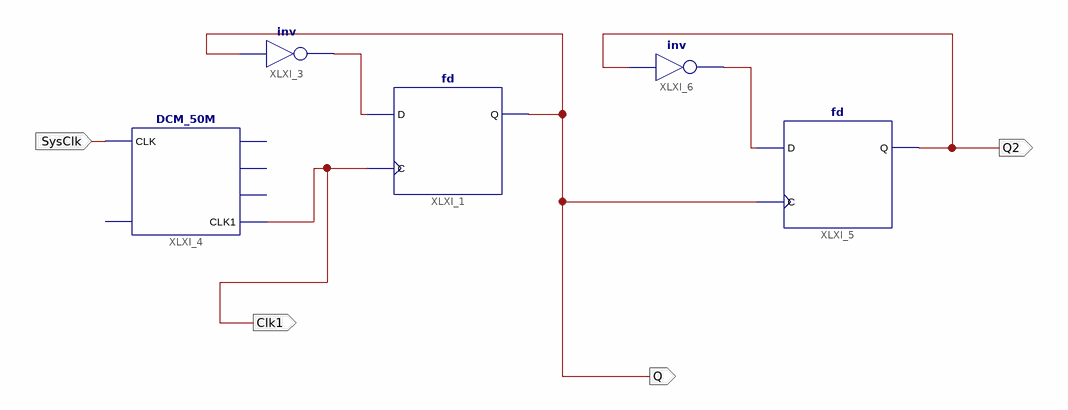
[diagram p0: schematic sheet 1]
// Xilinx ISE schematic Experiment1.sch (spartan3e) as structural Verilog: 5 symbols, 4 ports
module Experiment1 (
  input  SysClk,
  output Q,
  output Clk1,
  output Q2
);

  wire XLXN_1, XLXN_15;

  fd XLXI_1 (.C(Clk1), .D(XLXN_1), .Q(Q));
  not XLXI_3 (XLXN_1, Q);
  DCM_50M XLXI_4 (.CLK(SysClk), .CLK1(Clk1));  // open: RST, CLK1M, CLK10k, CLK1k
  fd XLXI_5 (.C(Q), .D(XLXN_15), .Q(Q2));
  not XLXI_6 (XLXN_15, Q2);
endmodule
